# EAGLE design arcade2 (EAGLE 6.1)
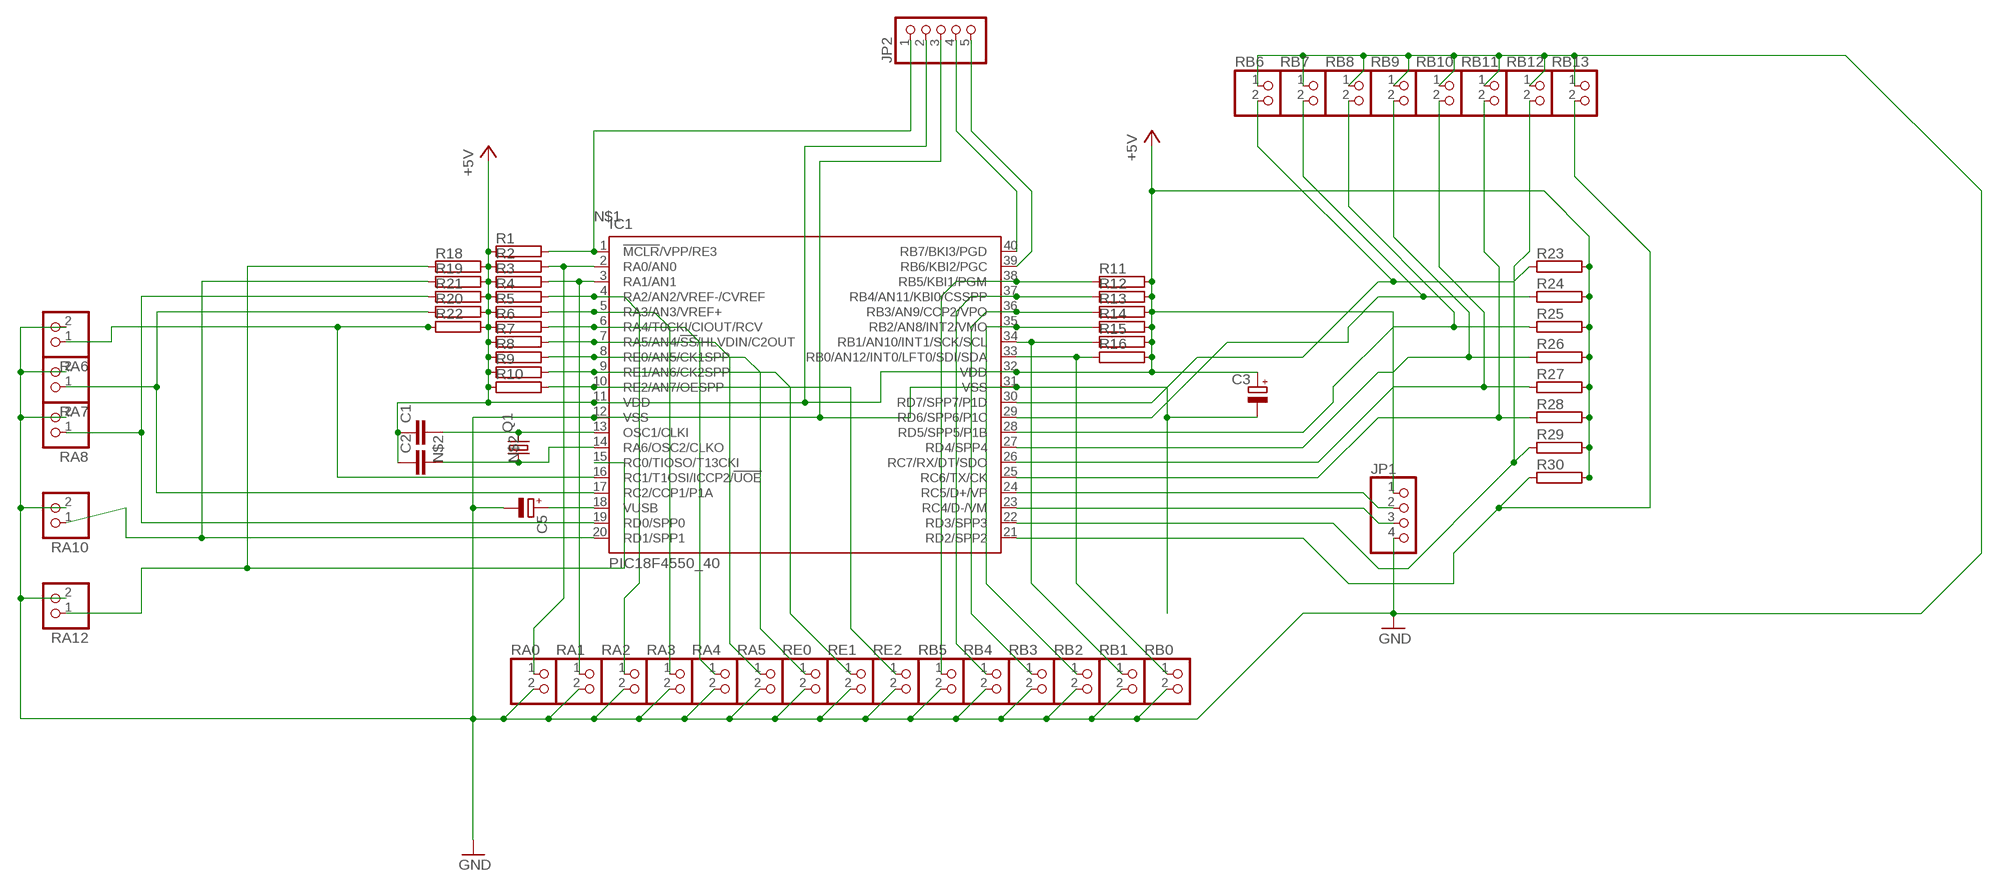
[diagram p0: schematic, sheet 1]

## Parts
C1  C10/4  [C10B4]
C2  C10/4  [C10B4]
C3  CPOL-EUB45181C  [B45181C]
C5  CPOL-EUB45181C  [B45181C]
IC1  PIC18F4550_40  [DIL40]
JP1  PINHD-1X4/90  [1X04/90]
JP2  PINHD-1X5/90  [1X05/90]
Q1  CRYSTALHC33U-V  [HC33U-V]
R1  RAC01  [AC01]
R2  RAC01  [AC01]
R3  RAC01  [AC01]
R4  RAC01  [AC01]
R5  RAC01  [AC01]
R6  RAC01  [AC01]
R7  RAC01  [AC01]
R8  RAC01  [AC01]
R9  RAC01  [AC01]
R10  RAC01  [AC01]
R11  RAC01  [AC01]
R12  RAC01  [AC01]
R13  RAC01  [AC01]
R14  RAC01  [AC01]
R15  RAC01  [AC01]
R16  RAC01  [AC01]
R18  RAC01  [AC01]
R19  RAC01  [AC01]
R20  RAC01  [AC01]
R21  RAC01  [AC01]
R22  RAC01  [AC01]
R23  RAC01  [AC01]
R24  RAC01  [AC01]
R25  RAC01  [AC01]
R26  RAC01  [AC01]
R27  RAC01  [AC01]
R28  RAC01  [AC01]
R29  RAC01  [AC01]
R30  RAC01  [AC01]
RA0  PINHD-1X2/90  [1X02/90]
RA1  PINHD-1X2/90  [1X02/90]
RA2  PINHD-1X2/90  [1X02/90]
RA3  PINHD-1X2/90  [1X02/90]
RA4  PINHD-1X2/90  [1X02/90]
RA5  PINHD-1X2/90  [1X02/90]
RA6  PINHD-1X2/90  [1X02/90]
RA7  PINHD-1X2/90  [1X02/90]
RA8  PINHD-1X2/90  [1X02/90]
RA10  PINHD-1X2/90  [1X02/90]
RA12  PINHD-1X2/90  [1X02/90]
RB0  PINHD-1X2/90  [1X02/90]
RB1  PINHD-1X2/90  [1X02/90]
RB2  PINHD-1X2/90  [1X02/90]
RB3  PINHD-1X2/90  [1X02/90]
RB4  PINHD-1X2/90  [1X02/90]
RB5  PINHD-1X2/90  [1X02/90]
RB6  PINHD-1X2/90  [1X02/90]
RB7  PINHD-1X2/90  [1X02/90]
RB8  PINHD-1X2/90  [1X02/90]
RB9  PINHD-1X2/90  [1X02/90]
RB10  PINHD-1X2/90  [1X02/90]
RB11  PINHD-1X2/90  [1X02/90]
RB12  PINHD-1X2/90  [1X02/90]
RB13  PINHD-1X2/90  [1X02/90]
RE0  PINHD-1X2/90  [1X02/90]
RE1  PINHD-1X2/90  [1X02/90]
RE2  PINHD-1X2/90  [1X02/90]

## Nets
N$1: IC1.1(!MCLR!/VPP/RE3) JP2.1 R1.2
N$2: C2.2 IC1.14(RA6/OSC2/CLKO) Q1.1
N$4: IC1.40(RB7/BKI3/PGD) JP2.4
N$5: C5.+ IC1.18(VUSB)
N$6: IC1.39(RB6/KBI2/PGC) JP2.5
N$7: IC1.3(RA1/AN1) R3.2 RA1.1
N$9: IC1.24(RC5/D+/VP) JP1.2
N$10: IC1.23(RC4/D-/VM) JP1.3
N$11: C3.- C5.- IC1.12(VSS) IC1.31(VSS) JP1.4 JP2.3 RA0.2 RA1.2 RA2.2 RA3.2 RA4.2 RA5.2 RA6.2 RA7.2 RA8.2 RA10.2 RA12.2 RB0.2 RB1.2 RB2.2 RB3.2 RB4.2 RB5.2 RB6.1 RB7.1 RB8.1 RB9.1 RB10.1 RB11.1 RB12.1 RB13.1 RE0.2 RE1.2 RE2.2 ; supply symbol labelled GND
N$12: IC1.2(RA0/AN0) R2.2 RA0.1
N$13: IC1.4(RA2/AN2/VREF-/CVREF) R4.2 RA2.1
N$14: IC1.7(RA5/AN4/!SS!/HLVDIN/C2OUT) R7.2 RA5.1
N$16: IC1.9(RE1/AN6/CK2SPP) R9.2 RE1.1
N$18: IC1.38(RB5/KBI1/PGM) R11.1 RB5.1
N$19: IC1.37(RB4/AN11/KBI0/CSSPP) R12.1 RB4.1
N$20: IC1.36(RB3/AN9/CCP2/VPO) R13.1 RB3.1
N$21: IC1.35(RB2/AN8/INT2/VMO) R14.1 RB2.1
N$22: IC1.34(RB1/AN10/INT1/SCK/SCL) R15.1 RB1.1
N$23: IC1.6(RA4/T0CKI/CIOUT/RCV) R6.2 RA4.1
N$26: IC1.10(RE2/AN7/OESPP) R10.2 RE2.1
N$29: IC1.5(RA3/AN3/VREF+) R5.2 RA3.1
N$31: IC1.30(RD7/SPP7/P1D) R23.1 RB6.2
N$32: IC1.28(RD5/SPP5/P1B) R25.1 RB8.2
N$33: IC1.29(RD6/SPP6/P1C) R24.1 RB7.2
N$34: IC1.27(RD4/SPP4) R26.1 RB9.2
N$36: IC1.25(RC6/TX/CK) R28.1 RB11.2
N$37: IC1.15(RC0/TIOSO/T13CKI) R18.1 RA12.1
N$38: C1.1 C2.1 C3.+ IC1.11(VDD) IC1.32(VDD) JP1.1 JP2.2 R1.1 R2.1 R3.1 R4.1 R5.1 R6.1 R7.1 R8.1 R9.1 R10.1 R11.2 R12.2 R13.2 R14.2 R15.2 R16.2 R18.2 R19.2 R20.2 R21.2 R22.2 R23.2 R24.2 R25.2 R26.2 R27.2 R28.2 R29.2 R30.2 ; supply symbol labelled +5V
N$39: C1.2 IC1.13(OSC1/CLKI) Q1.2
N$40: IC1.22(RD3/SPP3) R29.1 RB12.2
N$41: IC1.21(RD2/SPP2) R30.1 RB13.2
N$42: IC1.20(RD1/SPP1) R19.1 RA10.1
N$43: IC1.33(RB0/AN12/INT0/LFT0/SDI/SDA) R16.1 RB0.1
N$44: IC1.8(RE0/AN5/CK1SPP) R8.2 RE0.1
N$45: IC1.19(RD0/SPP0) R21.1 RA8.1
N$49: IC1.17(RC2/CCP1/P1A) R20.1 RA7.1
N$51: IC1.16(RC1/T1OSI/ICCP2/!UOE) R22.1 RA6.1
N$60: IC1.26(RC7/RX/DT/SDO) R27.1 RB10.2

## Library data of the parts
C1 C2 = capacitor-wima:C: CAPACITOR naming: grid - package width
C3 C5 = resistor:CPOL-EU: POLARIZED CAPACITOR, European symbol
IC1 = microchip:PIC18F4*_40: USB Microcontrollers with nanoWatt Technology High-Performance, Enhanced Flash, 28/40/44-Pin, Source: http://ww1.microchip.com/downloads/en/devicedoc/39632c.pdf; MF: MICROCHIP; MPN: PIC18F4550-I/P; OC_FARNELL: 9321357; OC_NEWARK: 74K8623
JP1 = pinhead:PINHD-1X4: PIN HEADER
JP2 = pinhead:PINHD-1X5: PIN HEADER
Q1 = crystal:CRYSTAL: CRYSTAL; OC_FARNELL: unknown; OC_NEWARK: unknown
R1-R16 R18-R30 = resistor-power:R: Power Resitor; OC_FARNELL: unknown; OC_NEWARK: unknown
RA0 RA1-RA8 RA10 RA12 RB0 RB1-RB13 RE0 RE1 RE2 = pinhead:PINHD-1X2: PIN HEADER

## Board
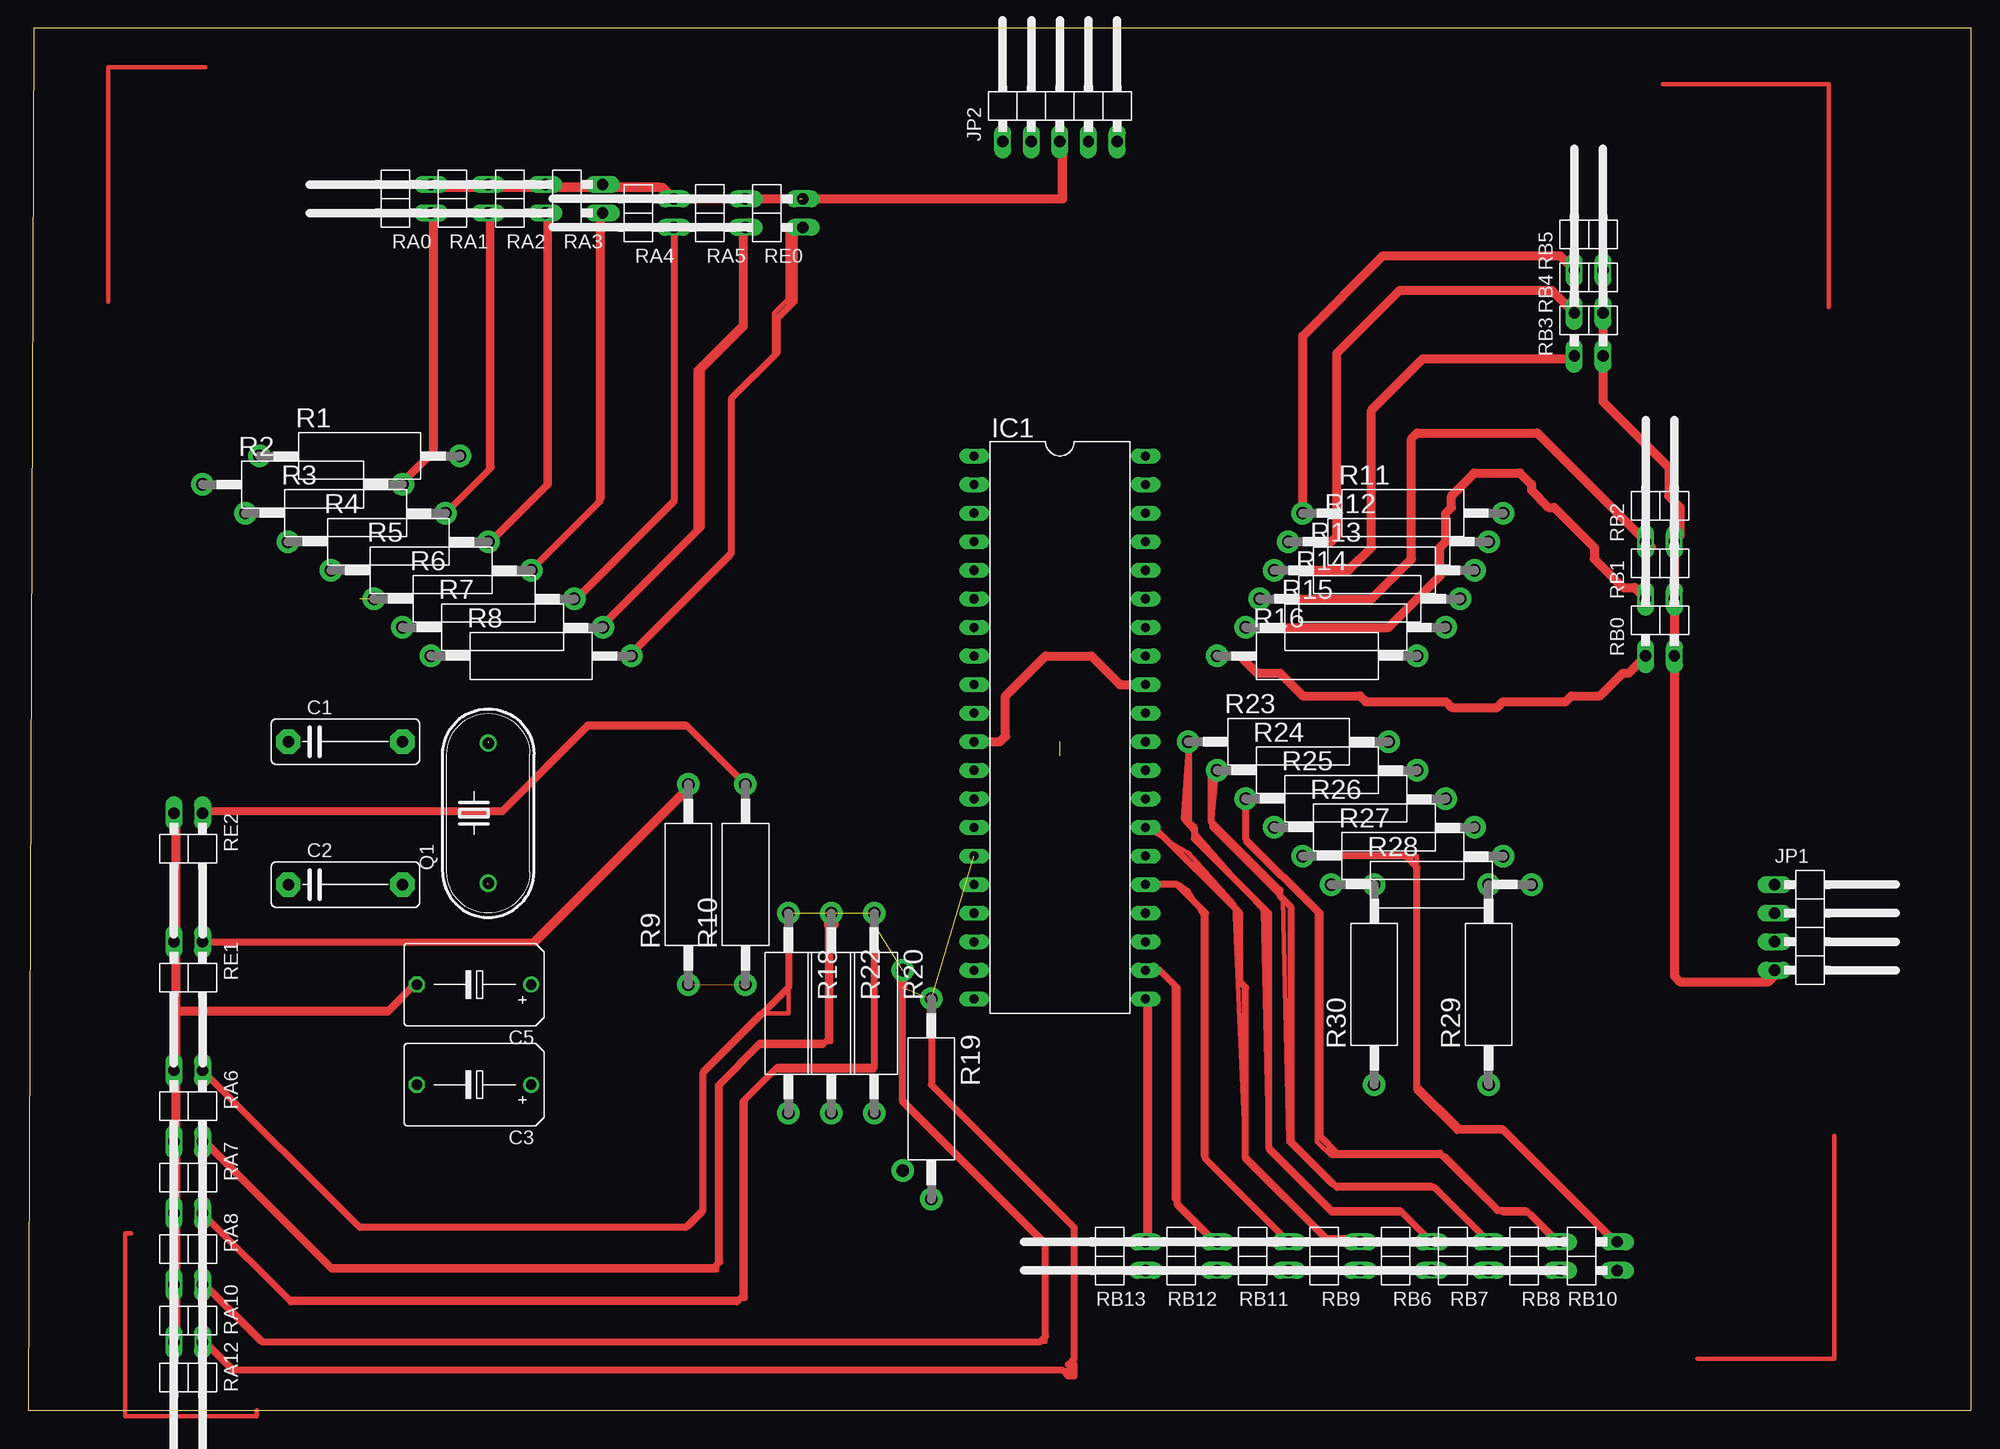
[diagram p1: board, top side]
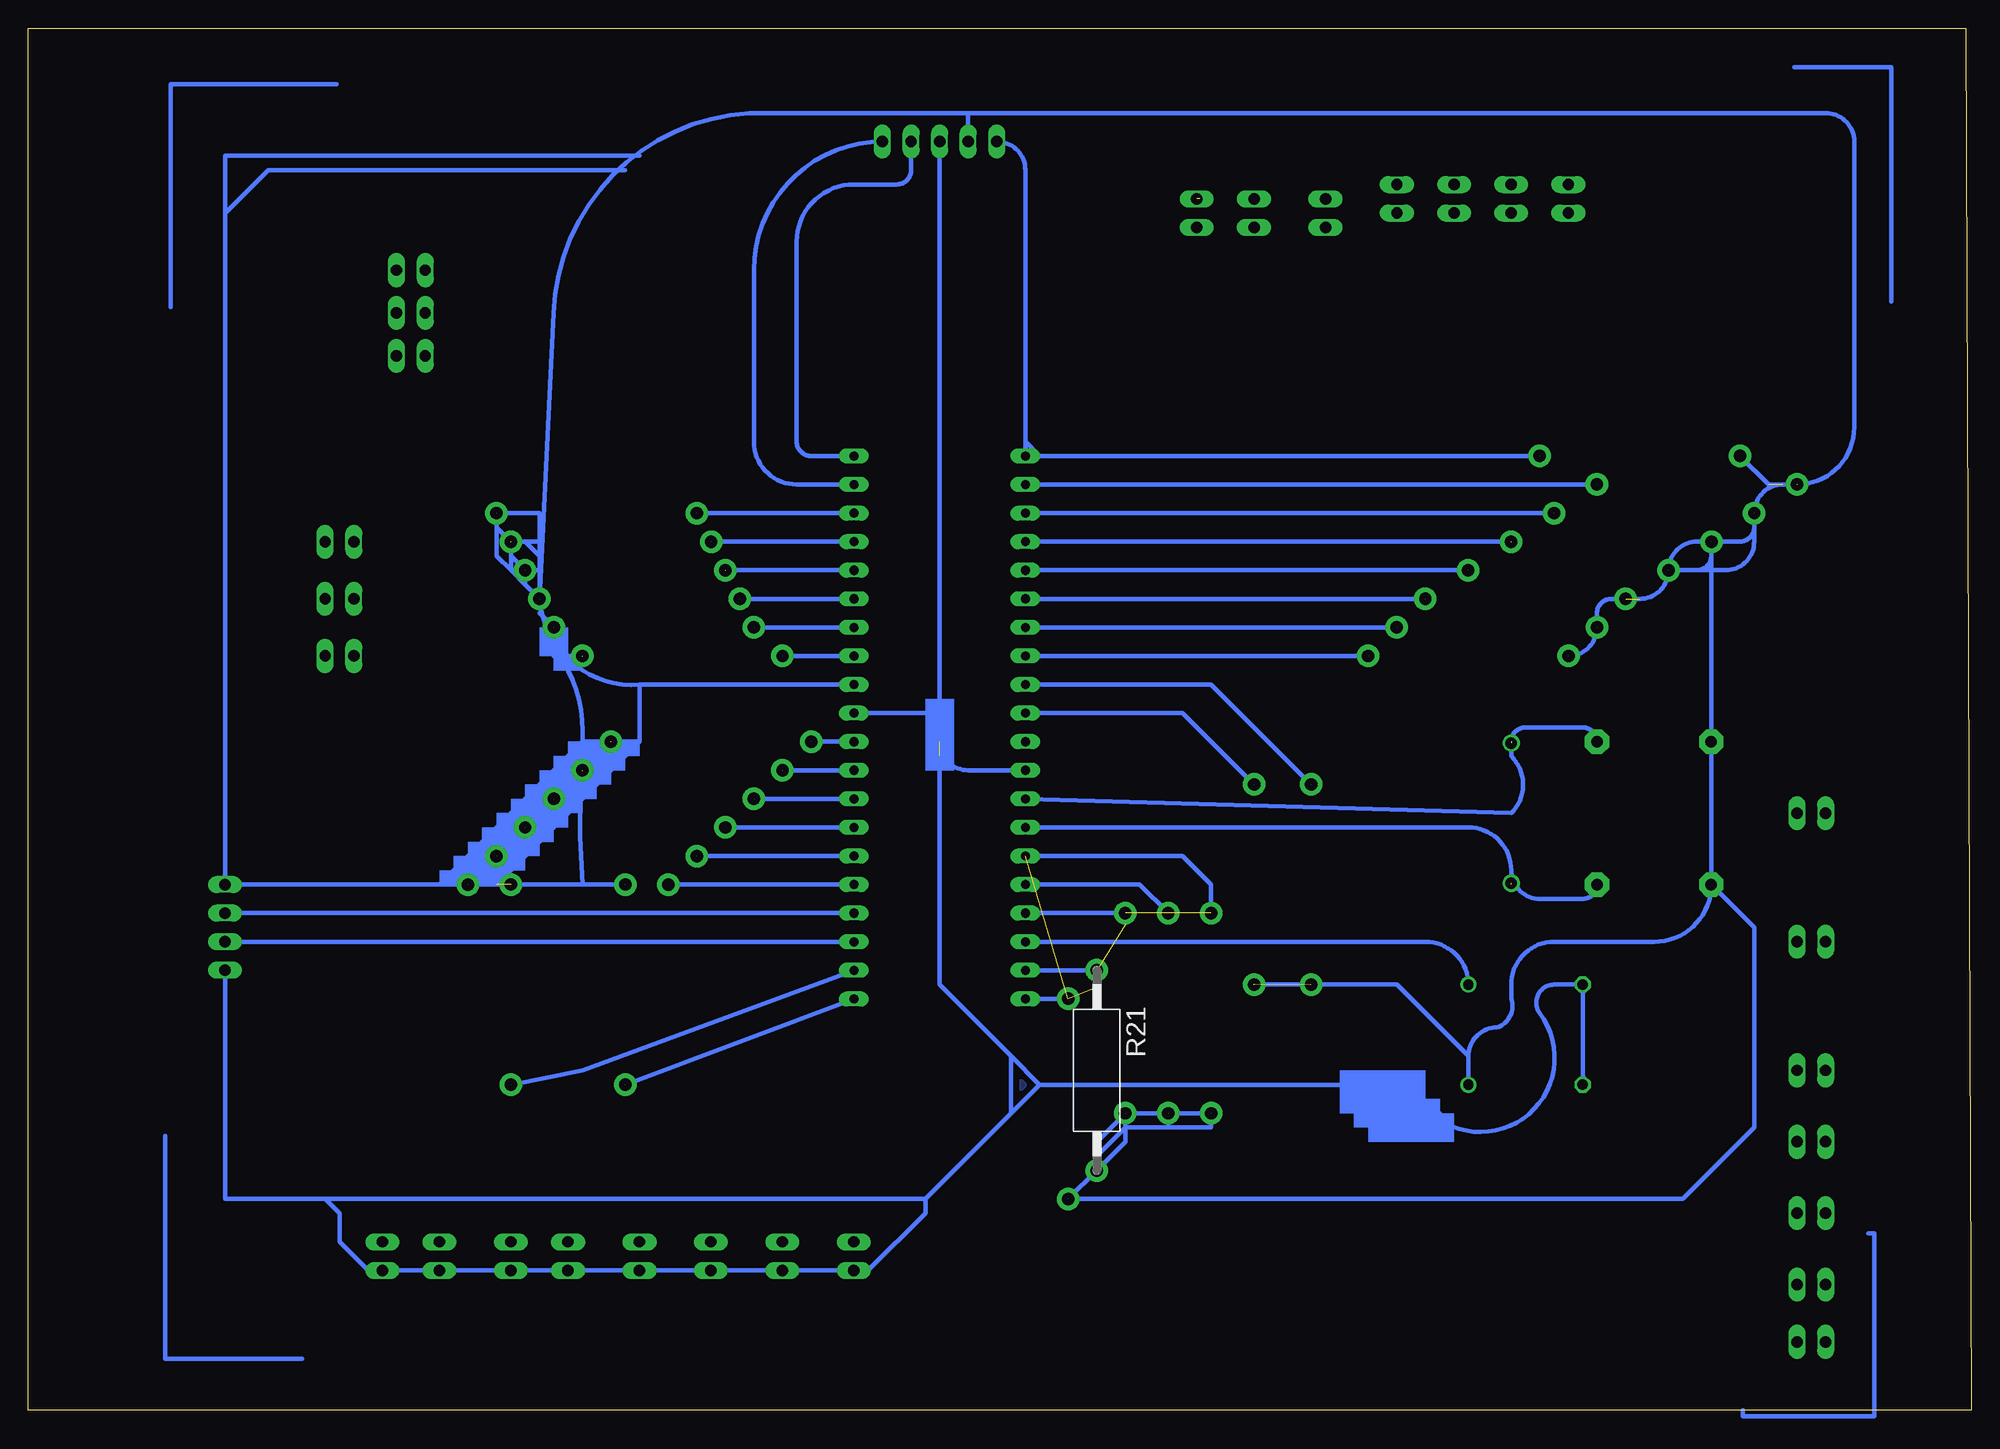
[diagram p2: board, bottom side, seen from below]

Size 172.7 x 122.86 mm. Coordinates in mm from the lower left corner, seen from the top.
Outline: 0,0 172.7,0 172.7,122.86 0.51,122.86 0,0
Copper layers (1*16): Top 0.1mm / dielectric 1.5mm / Bottom 0.1mm
Design rules: minimum track width 0.5mm, minimum drill 0.5mm, track to track 0.5mm, track to pad 0.5mm, pad to pad 0.5mm, via to via 0.5mm, smd to smd 8mil, copper to edge 40mil, drill to drill 8mil, minimum pad ring 10mil, minimum via ring 8mil, stop-mask expansion 4mil, vias tented up to drill 0mil, thermal gap 10mil

### Footprints (pad centres in the part's own frame; a part is rotated, then mirrored left to right if it is on the bottom)
C10B4 = drill 1.016 pad 2.159 octagon: 1 -5.08,0; 2 5.08,0
B45181C = drill 0.914: + -5.08,0 | drill 0.914 octagon: - 5.08,0
DIL40 = drill 0.813 long: 1 -24.13,-7.62; 2 -21.59,-7.62; 3 -19.05,-7.62; 4 -16.51,-7.62; 5 -13.97,-7.62; 6 -11.43,-7.62; 7 -8.89,-7.62; 8 -6.35,-7.62; 9 -3.81,-7.62; 10 -1.27,-7.62; 11 1.27,-7.62; 12 3.81,-7.62; 13 6.35,-7.62; 14 8.89,-7.62; 15 11.43,-7.62; 16 13.97,-7.62; 17 16.51,-7.62; 18 19.05,-7.62; 19 21.59,-7.62; 20 24.13,-7.62; 21 24.13,7.62; 22 21.59,7.62; 23 19.05,7.62; 24 16.51,7.62; 25 13.97,7.62; 26 11.43,7.62; 27 8.89,7.62; 28 6.35,7.62; 29 3.81,7.62; 30 1.27,7.62; 31 -1.27,7.62; 32 -3.81,7.62; 33 -6.35,7.62; 34 -8.89,7.62; 35 -11.43,7.62; 36 -13.97,7.62; 37 -16.51,7.62; 38 -19.05,7.62; 39 -21.59,7.62; 40 -24.13,7.62
1X04/90 = drill 1.016 long: 1 -3.81,-3.81; 2 -1.27,-3.81; 3 1.27,-3.81; 4 3.81,-3.81
1X05/90 = drill 1.016 long: 1 -5.08,-3.81; 2 -2.54,-3.81; 3 0,-3.81; 4 2.54,-3.81; 5 5.08,-3.81
HC33U-V = drill 1.016: 1 -6.223,0; 2 6.223,0
AC01 = drill 1.1 pad 2: 1 -8.9,0; 2 8.9,0
1X02/90 = drill 1.016 long: 1 -1.27,-3.81; 2 1.27,-3.81

### Placement (x,y rotation side)
C1  28.19,59.44 0 top
C2  28.19,46.74 0 top
C3  39.62,28.96 180 top
C5  39.62,37.85 180 top
IC1  91.69,60.71 270 top
JP1  159,42.93 270 top
JP2  91.69,116.59 0 top
Q1  40.89,53.09 90 top
R1  29.46,84.84 0 top
R2  24.38,82.3 0 top
R3  28.19,79.76 0 top
R4  32,77.22 0 top
R5  35.81,74.68 0 top
R6  39.62,72.14 0 top
R7  42.16,69.6 0 top
R8  44.7,67.06 0 top
R9  58.67,46.74 90 top
R10  63.75,46.74 90 top
R11  122.17,79.76 0 top
R12  120.9,77.22 0 top
R13  119.63,74.68 0 top
R14  118.36,72.14 0 top
R15  117.09,69.6 0 top
R16  114.55,67.06 0 top
R18  67.56,35.31 270 top
R19  80.26,27.69 270 top
R20  75.18,35.31 270 top
R21  77.72,30.23 270 bottom
R22  71.37,35.31 270 top
R23  112.01,59.44 0 top
R24  114.55,56.9 0 top
R25  117.09,54.36 0 top
R26  119.63,51.82 0 top
R27  122.17,49.28 0 top
R28  124.71,46.74 0 top
R29  129.79,37.85 90 top
R30  119.63,37.85 90 top
RA0  32,107.7 90 top
RA1  37.08,107.7 90 top
RA2  42.16,107.7 90 top
RA3  47.24,107.7 90 top
RA4  53.59,106.43 90 top
RA5  59.94,106.43 90 top
RA6  14.22,26.42 180 top
RA7  14.22,20.07 180 top
RA8  14.22,13.72 180 top
RA10  14.22,7.37 180 top
RA12  14.22,2.29 180 top
RB0  145.03,70.87 0 top
RB1  145.03,75.95 0 top
RB2  145.03,81.03 0 top
RB3  138.68,97.54 0 top
RB4  138.68,101.35 0 top
RB5  138.68,105.16 0 top
RB6  120.9,13.72 90 top
RB7  125.98,13.72 90 top
RB8  132.33,13.72 90 top
RB9  114.55,13.72 90 top
RB10  137.41,13.72 90 top
RB11  108.2,13.72 90 top
RB12  101.85,13.72 90 top
RB13  95.5,13.72 90 top
RE0  65.02,106.43 90 top
RE1  14.22,37.85 180 top
RE2  14.22,49.28 180 top

### Tracks (layer width: path | path; a pad name or v marks a point on that pad's centre or on a via)
N$1  (1 unrouted)
  Bottom 0.406: JP2.1 arc90 84.07,110.24 84.07,86.11 | 84.07,86.11 IC1.1 82.8,84.84 | R1.2 82.8,84.84 | 82.8,84.84 84.07,86.11
N$2  (1 unrouted)
  Bottom 0.406: 40.89,46.74 40.89,48.01 | 40.89,48.01 arc-90 44.7,51.82 IC1.14 | 40.89,48.01 arc-90 38.35,45.47 34.54,45.47 arc-90 C2.2
N$3
  pour Bottom: 82.8,28.96 85.34,31.5 85.34,26.42
N$4
  Bottom 0.406: JP2.4 94.23,110.24 arc90 95.5,108.97 99.31,108.97 arc-90 104.39,103.89 104.39,86.11 arc-90 103.12,84.84 IC1.40
N$5
  Bottom 0.406: IC1.18 48.51,41.66 arc90 C5.+
N$6
  Bottom 0.406: JP2.5 arc-90 108.2,101.35 108.2,86.11 arc-90 104.39,82.3 IC1.39
N$7  (1 unrouted)
  Top 0.406: RA1.1 40.89,83.56 R3.2
  Bottom 0.406: R3.2 IC1.3
N$9
  Bottom 0.406: JP1.2 IC1.24
N$10
  Bottom 0.406: JP1.3 100.58,41.66 IC1.23
N$11  (2 unrouted)
  Top 0.406: 68.58,107.7 RA5.2 RA4.2 56.13,108.97 RA3.2 RA2.2 RA1.2 RA0.2 | 69.09,107.7 91.69,107.7 JP2.3 | RA12.2 RA10.2 RA8.2 RA7.2 RA6.2 12.95,35.31 | 12.95,35.31 RE1.2 RE2.2 | 12.95,35.31 32,35.31 C5.-
  Top 0.813: 36.07,108.71 56.39,108.71 RA4.2 68.58,107.7 69.09,107.7 91.95,107.7 91.95,112.78 | RB5.2 RB4.2 | RB4.2 139.95,97.28 140.21,97.03 140.21,97.28 RB4.2 | RB4.2 RB3.2 139.95,89.66 145.8,83.82 145.8,81.28 146.81,80.26 146.81,77.72 RB2.2 RB1.2 RB0.2 146.3,38.61 146.81,38.1 154.69,38.1 155.19,38.61 JP1.4
  Bottom 0.406: JP2.3 91.69,61.98 | IC1.31 91.69,61.98 | 91.69,61.98 91.69,59.44 arc-90 89.15,56.9 IC1.12 | C3.- C5.- 37.08,37.85 arc-127 38.35,35.31 arc196 49.78,28.96 56.13,28.96 | 56.13,28.96 82.8,28.96 | 82.8,28.96 85.34,31.5 | 85.34,31.5 91.69,37.85 91.69,58.17 | 47.24,26.42 53.59,26.42 | 53.59,26.42 54.86,27.69 | 54.86,27.69 56.13,28.96 | 47.24,25.15 52.32,25.15 53.59,26.42 | 54.86,27.69 49.78,27.69 47.24,25.15 | 47.24,25.15 45.97,25.15 | JP1.4 155.19,18.8 146.3,18.8 | 146.3,18.8 92.96,18.8 | 92.96,18.8 85.34,26.42 | 85.34,26.42 82.8,28.96 | 85.34,31.5 85.34,26.42 | 92.96,18.8 92.96,17.53 98.04,12.45 RB13.1 RB12.1 RB11.1 RB9.1 RB6.1 RB7.1 RB8.1 RB10.1 142.49,12.45 145.03,14.99 145.03,17.53 146.3,18.8
N$12  (1 unrouted)
  Top 0.406: RA0.1 35.81,84.83 R2.2
  Bottom 0.406: R2.2 IC1.2
N$13  (1 unrouted)
  Top 0.406: RA2.1 45.97,82.29 R4.2
  Bottom 0.406: R4.2 IC1.4
N$14  (1 unrouted)
  Top 0.406: R7.2 59.94,78.49 59.94,92.46 63.75,96.27 RA5.1
  Bottom 0.406: R7.2 IC1.7
N$15
  Top 0.406: 15.75,119.38 7.11,119.38 7.11,98.55
N$16  (1 unrouted)
  Top 0.406: RE1.1 15.75,41.66 44.69,41.66 R9.2
  Top 0.61: 15.75,41.66 45.21,41.66 58.93,55.37
  Bottom 0.406: IC1.9 67.56,64.52 R9.2
N$17
  Bottom 0.406: 7.11,98.55 7.11,119.38 15.75,119.38
N$18  (via drill 0.6)  (1 unrouted)
  Top 0.813: v113.28,79.76 113.28,95.5 120.4,102.62 136.14,102.62 RB5.1
  Bottom 0.406: v113.28,79.76 IC1.38
N$19  (1 unrouted)
  Top 0.813: R12.1 115.82,77.22 116.33,77.72 116.33,93.98 121.92,99.57 135.38,99.57 RB4.1
  Bottom 0.406: R12.1 IC1.37
N$20  (1 unrouted)
  Top 0.813: R13.1 117.35,74.68 119.38,76.71 119.38,88.9 123.95,93.47 137.16,93.47 RB3.1
  Bottom 0.406: R13.1 IC1.36
N$21  (via drill 0.6)  (1 unrouted)
  Top 0.813: v109.47,72.14 119.38,72.14 122.94,75.69 122.94,86.36 123.44,86.87 134.11,86.87 RB2.1 144.27,76.71
  Bottom 0.406: v109.47,72.14 IC1.35
N$22  (1 unrouted)
  Top 0.813: R15.1 120.9,69.6 125.48,74.17 125.48,76.71 125.98,77.22 125.98,79.76 126.49,80.26 126.49,81.28 128.52,83.31 132.59,83.31 133.6,82.3 133.6,81.79 135.13,80.26 135.64,80.26 139.19,76.71 139.19,75.69 141.73,73.15 142.75,73.15 RB1.1
  Bottom 0.406: R15.1 IC1.34
N$23  (1 unrouted)
  Top 0.406: RA4.1 57.4,81.02 R6.2
  Top 0.61: RA4.1 57.4,80.77 48.77,72.14
  Bottom 0.406: R6.2 IC1.6
N$24
  Bottom 0.406: 148.34,4.57 160.53,4.57 160.53,24.38
N$25
  Top 0.406: 148.34,4.57 160.53,4.57 160.53,24.38
N$26  (2 unrouted)
  Top 0.406: RE2.1 42.16,53.09 49.78,60.71 58.67,60.71 R10.2
  Bottom 0.406: IC1.10 70.1,61.98 R10.2
N$27
  Top 0.406: 145.29,117.86 160.02,117.86 160.02,99.06 160.02,98.55 160.02,98.04
N$28
  Bottom 0.406: 145.29,117.86 160.02,117.86 160.02,98.04
N$29  (2 unrouted)
  Top 0.406: RA3.1 51.05,81.03 50.8,80.77
  Top 0.61: R5.2 50.8,80.77 50.8,106.17
  Bottom 0.406: R5.2 IC1.5
N$30
  Bottom 0.406: 9.14,15.75 8.64,15.75 8.64,-0.51 20.32,-0.51 20.32,0
N$31  (via drill 0.6)  (1 unrouted)
  Top 0.406: v103.12,59.44 102.62,52.58 109.73,44.45 110.24,23.11 115.82,17.53 122.17,17.53 124.46,15.24 RB6.2
  Top 0.61: v103.12,59.44 103.12,52.32 103.63,51.82 103.63,50.8 110.24,44.2 110.24,23.37 115.82,17.78 121.92,17.78 124.46,15.24
  Bottom 0.406: v103.12,59.44 IC1.30
N$32  (1 unrouted)
  Top 0.406: R25.1 108.19,51.83 108.2,51.82 108.2,50.55 114.55,44.2 114.55,23.88 115.82,22.61 125.98,22.61 131.06,17.53 133.6,17.53 RB8.2
  Bottom 0.406: R25.1 IC1.28
N$33  (1 unrouted)
  Top 0.406: R24.1 105.15,51.83 111.25,45.72 111.51,45.47 112.01,23.88 115.82,20.07 124.71,20.07 124.97,19.81 RB7.2
  Top 0.61: 130.05,15.24 129.54,15.24 124.97,19.81 116.33,19.81 112.27,23.88 112.27,44.7 111.25,45.72 111.25,46.23 105.16,52.32 105.16,56.39 R24.1
  Bottom 0.406: IC1.29 R24.1
N$34  (via drill 0.6)
  Top 0.406: IC1.27 103.12,49.53 107.19,44.96 108.2,22.61 115.82,14.99 RB9.2
  Bottom 0.406: R26.1 IC1.27
  other vias: 99.31,51.82
N$36  (via drill 0.6)
  Top 0.406: IC1.25 102.11,46.74 102.36,46.74 103.12,46.23 104.39,43.94 104.39,22.61 104.65,22.35 RB11.2
  Top 0.61: 112.78,14.73 112.27,14.73 104.65,22.35 104.65,44.2 102.11,46.74 99.06,46.74
  Bottom 0.406: R28.1 IC1.25
  other vias: 99.31,46.74
N$37  (2 unrouted)
  Top 0.406: 80.26,35.56 80.26,28.96 | 92.96,16.26 92.96,4.06 92.96,3.56 91.95,3.56 | 18.29,3.56 18.03,3.56 RA12.1
  Top 0.61: 80.26,36.07 80.26,28.96 92.96,16.26 92.96,4.57 92.46,4.06 92.96,4.06 92.96,3.05 92.46,3.05 91.95,3.56 18.29,3.56 15.75,6.1
  Top 0.813: 80.26,36.58 80.26,36.07 80.26,35.56
  Bottom 0.406: IC1.15 70.1,49.28 67.56,46.74 R18.1
N$38  (29 unrouted)
  Top 0.813: IC1.11 86.36,59.44 86.87,59.94 86.87,63.5 90.42,67.06 94.49,67.06 97.03,64.52 IC1.32
  Bottom 0.406: 125.98,67.06 R16.2 124.71,65.79 | 77.72,22.61 77.72,23.88 R20.2 | R20.2 R22.2 | R22.2 R18.2 67.56,25.15 71.37,25.15 | R21.2 R19.2 25.65,18.8 19.3,25.15 19.3,42.93 C2.1 | R21.2 77.72,22.61 | 77.72,22.61 75.18,25.15 | 75.18,25.15 R20.2 | 75.18,25.15 71.37,25.15 | R22.2 71.37,25.15 | 75.18,25.15 75.18,23.88 R21.2 | 124.71,65.79 125.98,68.33 R15.2 127.25,70.87 | 124.71,65.79 arc31 123.44,59.44 | JP2.2 89.15,115.32 | 89.15,115.32 106.93,115.32 arc-90 125.98,97.54 R14.2 | R14.2 arc-90 118.36,64.52 | 118.36,64.52 IC1.32 | 89.15,115.32 12.95,115.32 arc90 10.41,112.78 10.41,87.38 arc90 R2.1 18.02,82.3 R1.1 | 16.76,82.3 arc-90 R3.1 19.3,78.49 | 19.3,78.49 arc90 20.57,77.22 R4.1 | R4.1 24.38,77.22 arc-90 R5.1 | R5.1 arc90 29.46,72.14 32,72.14 arc-90 33.27,70.87 R7.1 arc90 R8.1 | C2.1 C1.1 23.11,74.68 | 23.11,74.68 23.11,75.95 | R4.1 23.11,75.95 | 23.11,75.95 arc90 24.38,74.68 | 24.38,74.68 R5.1 | 24.38,74.68 23.11,74.68 | 23.11,74.68 21.84,74.68 arc-90 19.3,77.22 19.3,78.49 | C3.+ 44.7,31.5 | 44.7,31.5 arc90 42.16,34.04 arc-90 40.89,36.58 40.89,37.85 arc90 37.08,41.66 28.19,41.66 arc-90 C2.1 | 155.19,106.43 JP1.1 136.14,46.74 | 155.19,106.43 155.19,111.51 118.36,111.51 | 119.63,110.24 151.38,110.24 155.19,106.43 | R30.2 123.44,46.74 | 123.44,46.74 131.06,46.74 | 123.44,59.44 arc-8 123.44,46.74 | R28.2 132.33,48.01 | R27.2 129.79,50.55 | R26.2 127.25,53.09 | R25.2 124.71,55.63 | 124.71,55.63 R24.2 | R24.2 R23.2 | 122.17,59.44 123.44,59.44 | 123.44,59.44 124.71,58.17 | 125.98,56.9 127.25,55.63 | 128.52,54.36 129.79,53.09 | 131.06,51.82 132.33,50.55 | 133.6,49.28 136.14,46.74 | 136.14,46.74 R28.2 | R28.2 131.06,46.74 | 131.06,46.74 118.36,59.44
  Bottom 0.406: 118.36,59.44 R23.2 | 118.36,64.52 118.36,59.44 | R23.2 122.17,59.44 | 122.17,59.44 124.71,56.9 | 124.71,56.9 124.71,55.63 | 124.71,56.9 124.71,58.17 | 124.71,58.17 125.98,56.9 | 125.98,56.9 R25.2 | R25.2 127.25,53.09 | 127.25,53.09 127.25,55.63 | 127.25,55.63 128.52,54.36 | 128.52,54.36 R26.2 | R26.2 129.79,50.55 | 129.79,50.55 129.79,53.09 | 129.79,53.09 131.06,51.82 | 131.06,51.82 R27.2 | R27.2 132.33,48.01 | 132.33,48.01 132.33,50.55 | 132.33,50.55 133.6,49.28 | 133.6,49.28 R28.2 | R24.2 124.71,56.9 | R10.1 51.05,37.85 44.7,31.5 | 131.06,78.49 131.06,75.95 129.79,74.68 | 129.79,75.95 129.79,74.68 | 129.79,74.68 128.52,73.41 | 131.06,78.49 R11.2 127.25,79.76 R14.2 | 131.06,78.49 R12.2 | R12.2 129.79,75.95 | 129.79,75.95 R13.2 | R13.2 128.52,73.41 | 128.52,73.41 R14.2 | 127.25,77.22 128.52,77.22 | R12.2 128.52,77.22 | 128.52,77.22 127.25,75.95 | 127.25,74.68 R13.2
N$39  (1 unrouted)
  Bottom 0.406: IC1.13 40.89,53.09 arc-90 40.89,58.17 40.89,59.44 arc90 39.62,60.71 34.54,60.71 arc90 C1.2
N$40  (1 unrouted)
  Top 0.406: IC1.22 99.57,39.12 | 100.58,39.12 101.85,37.85 101.85,18.8 RB12.2
  Top 0.61: 99.57,39.12 100.58,39.12 102.11,37.59 102.11,18.29 105.66,14.73
  Bottom 0.406: R29.1 123.44,30.23 IC1.22
N$41  (1 unrouted)
  Top 0.406: IC1.21 RB13.2
  Bottom 0.406: R30.1 IC1.21
N$42  (2 unrouted)
  Top 0.406: 77.72,37.59 77.72,27.69 90.42,14.99 90.42,6.6 90.42,6.1 20.83,6.1 20.57,6.1 RA10.1
  Top 0.61: 15.75,11.18 20.83,6.1 89.92,6.1 90.42,6.6 90.42,14.73 77.72,27.43 77.72,37.59
  Top 0.813: 77.72,39.12 77.72,37.59
  Bottom 0.406: IC1.20 R19.1
N$43  (1 unrouted)
  Top 0.813: R16.1 107.7,67.06 109.22,65.53 111.25,65.53 113.28,63.5 118.36,63.5 118.87,62.99 125.98,62.99 126.49,62.48 130.56,62.48 131.06,62.99 136.65,62.99 137.16,63.5 139.7,63.5 141.73,65.53 142.24,65.53 RB0.1
  Bottom 0.406: R16.1 IC1.33
N$44  (2 unrouted)
  Top 0.406: R8.2 62.48,75.95 62.48,89.92 66.29,93.73 66.29,97.54 67.56,98.81 67.56,103.89 RE0.1
  Top 0.61: 69.09,105.16 68.58,105.16 | 68.58,105.16 67.56,105.16 67.56,98.55 | 68.58,105.16 68.07,104.65 68.07,98.55 66.55,97.03 66.55,93.98 62.48,89.92 62.48,76.2 53.85,67.56
  Bottom 0.406: R8.2 IC1.8
N$45  (2 unrouted)
  Top 0.406: 75.18,43.18 75.18,30.48 75.18,30.23 66.29,30.23 63.75,27.69 63.75,9.91 23.11,9.91 15.75,17.27 RA8.1
  Top 0.61: 75.18,44.2 75.18,30.48 66.55,30.48 63.5,27.43 63.5,10.16 62.99,9.65 23.37,9.65 15.75,17.27
  Top 0.813: 75.18,44.2 75.18,43.18
  Bottom 0.406: IC1.19 R21.1
N$46
  Top 0.406: 9.14,15.75 8.64,15.75 8.64,-0.51 20.32,-0.51 20.32,0
N$47
  Top 0.61: 15.24,24.38 26.92,12.7 60.96,12.7 61.47,13.21 61.47,28.96 65.02,32.51 70.61,32.51 71.12,33.02 71.12,43.69
  Top 0.813: 71.63,44.2 71.63,43.18 71.12,43.18 71.12,43.69 71.12,44.2
N$48
  Top 0.61: 34.54,37.59 34.04,37.59 32,35.56 13.21,35.56 | 13.21,35.56 13.21,6.1 | 13.21,53.34 13.21,35.56
N$49  (2 unrouted)
  Top 0.406: 71.37,44.2 71.37,32.77 65.02,32.77 61.21,28.96 61.21,12.45 26.92,12.45 RA7.1
  Bottom 0.406: IC1.17 R20.1
N$50
  Top 0.61: 15.75,53.34 42.16,53.34 49.78,60.96 58.42,60.96 64.01,55.37
N$51  (2 unrouted)
  Top 0.406: 67.56,43.18 67.56,35.31 65.02,35.31 59.94,30.23 59.94,29.97 59.94,17.53 58.67,16.26 58.42,16.26 | 15.75,29.97 RA6.1
  Top 0.61: 67.56,44.2 67.56,37.59 59.94,29.97 59.94,17.78 58.42,16.26 29.46,16.26 15.75,29.97
  Top 0.813: 67.56,44.2 67.56,43.18
  Bottom 0.406: IC1.16 73.91,46.74 R22.1
N$53
  Top 0.61: 36.07,106.68 36.07,85.34 33.53,82.8
N$54
  Top 0.61: 37.08,79.76 41.15,83.82 41.15,106.17
N$55
  Top 0.61: 46.23,106.17 46.23,82.3 41.15,77.22
N$56
  Top 0.61: 51.31,69.6 51.31,70.1 59.44,78.23 59.44,92.46 63.5,96.52 63.5,105.16 64.01,105.66
N$57
  Top 0.61: 99.57,36.58 99.57,14.73
N$58
  Top 0.61: 118.87,15.24 115.32,15.24 108.2,22.35 108.2,37.59 107.7,38.1 107.7,44.2 100.08,51.82
N$59
  Top 0.61: 108.2,54.36 108.2,50.8 114.81,44.2 114.81,24.38 116.33,22.86 125.48,22.86 130.56,17.78 133.1,17.78 136.14,14.73
N$60  (1 unrouted)
  Top 0.406: R27.1 | 122.43,49.28 123.44,49.28 123.44,28.96 127.25,25.15 131.06,25.15 RB10.2
  Top 0.61: 141.22,14.73 131.06,24.89 127,24.89 123.44,28.45 123.44,48.26 122.43,49.28 R27.1
  Bottom 0.406: R27.1 IC1.26
(copper drawn outside any net)
  shapes: Bottom area x21